# EAGLE schematic untitled (EAGLE 9.6.2)
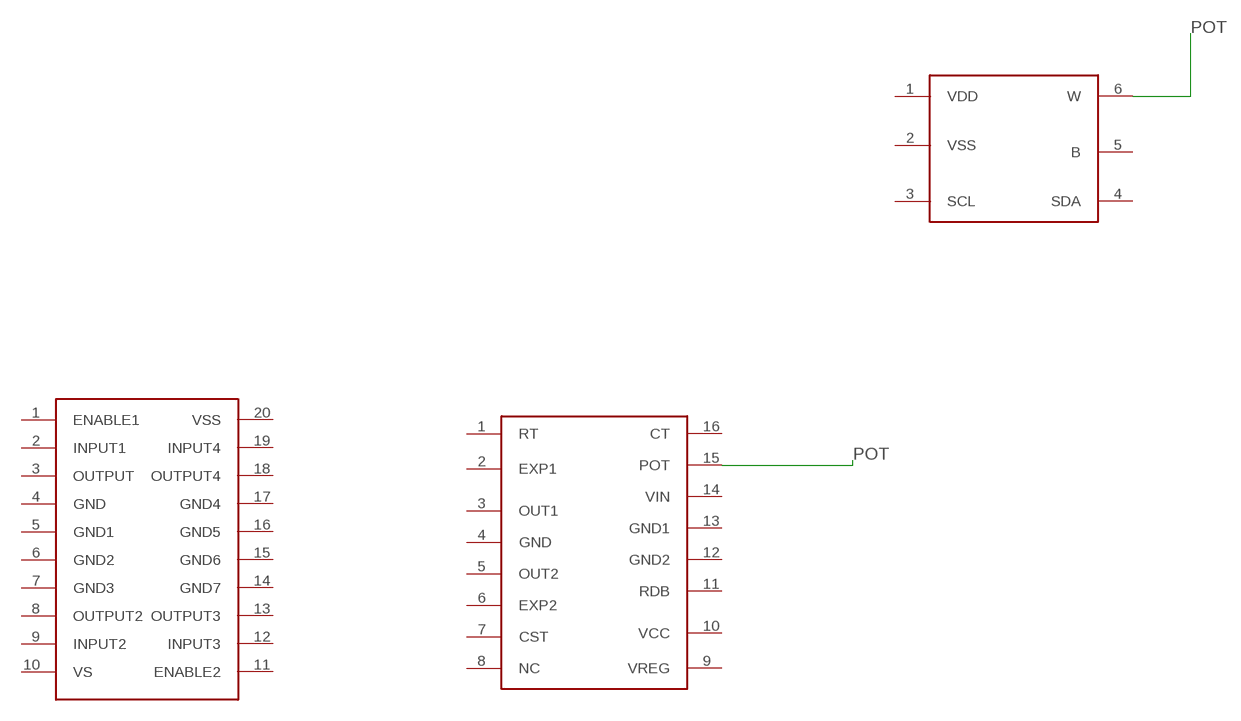
[diagram p0: schematic, sheet 1]

## Parts
U$1  AA51880  [SOP64P600X175-16N]
U$2  MCP4017  [SOT65P210X110-6N]
U$3  L293D  [SOIC127P1032X265-20N]

## Nets
N$1: U$2.6(W)
POT: U$1.15(POT)
Unconnected: U$1.1(RT) U$1.2(EXP1) U$1.3(OUT1) U$1.4(GND) U$1.5(OUT2) U$1.6(EXP2) U$1.7(CST) U$1.8(NC) U$1.9(VREG) U$1.10(VCC) U$1.11(RDB) U$1.12(GND2) U$1.13(GND1) U$1.14(VIN) U$1.16(CT) U$2.1(VDD) U$2.2(VSS) U$2.3(SCL) U$2.4(SDA) U$2.5(B) U$3.1(ENABLE1) U$3.2(INPUT1) U$3.3(OUTPUT) U$3.4(GND) U$3.5(GND1) U$3.6(GND2) U$3.7(GND3) U$3.8(OUTPUT2) U$3.9(INPUT2) U$3.10(VS) U$3.11(ENABLE2) U$3.12(INPUT3) U$3.13(OUTPUT3) U$3.14(GND7) U$3.15(GND6) U$3.16(GND5) U$3.17(GND4) U$3.18(OUTPUT4) U$3.19(INPUT4) U$3.20(VSS)

## Library data of the parts
U$1 = AA51880:AA51880: aa51880
U$2 = MCP4017:MCP4017: Digital potentiometer
U$3 = l293d:L293D: Motor driver